# EAGLE design dataBoard (EAGLE 9.4.2)
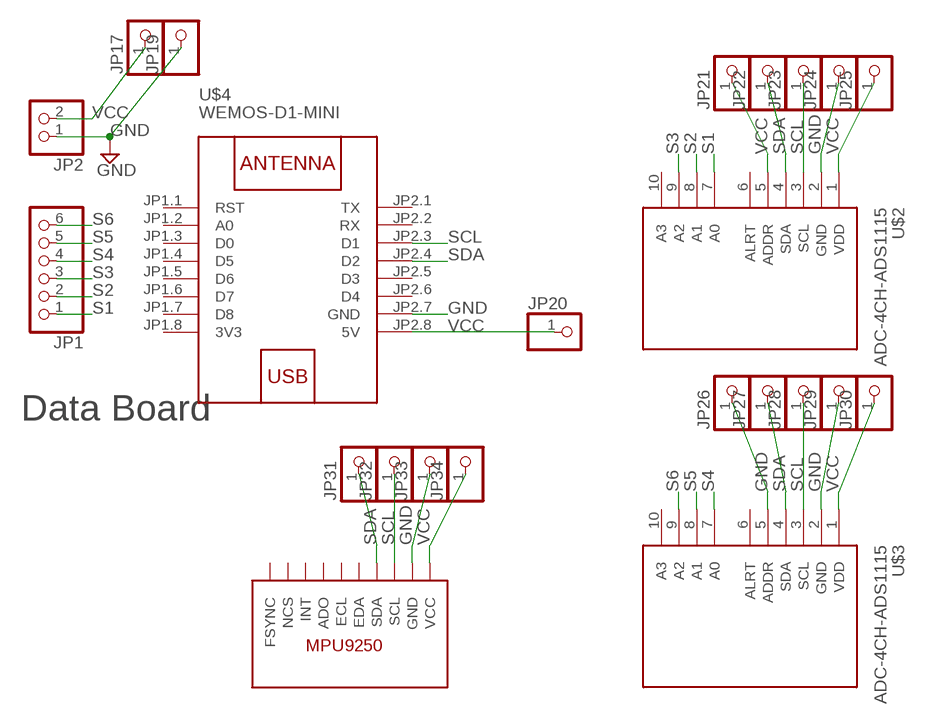
[diagram p0: schematic, sheet 1]

## Parts
JP1  PINHD-1X6  [1X06]
JP2  PINHD-1X2  [1X02]
JP17  PINHD-1X1  [1X01]
JP19  PINHD-1X1  [1X01]
JP20  PINHD-1X1  [1X01]
JP21  PINHD-1X1  [1X01]
JP22  PINHD-1X1  [1X01]
JP23  PINHD-1X1  [1X01]
JP24  PINHD-1X1  [1X01]
JP25  PINHD-1X1  [1X01]
JP26  PINHD-1X1  [1X01]
JP27  PINHD-1X1  [1X01]
JP28  PINHD-1X1  [1X01]
JP29  PINHD-1X1  [1X01]
JP30  PINHD-1X1  [1X01]
JP31  PINHD-1X1  [1X01]
JP32  PINHD-1X1  [1X01]
JP33  PINHD-1X1  [1X01]
JP34  PINHD-1X1  [1X01]
MPU1  MPU9250  [MPU9250]
U$2  ADC-4CH-ADS1115  [ADC-4CH-ADS1115]
U$3  ADC-4CH-ADS1115  [ADC-4CH-ADS1115]
U$4  WEMOS-D1-MINI  [WEMOS-D1-MINI]

## Nets
GND: JP2.1 JP19.1 JP24.1 JP26.1 JP29.1 JP33.1 MPU1.GND U$2.2(GND) U$3.2(GND) U$3.5(ADDR) U$4.JP2.7(GND)
S1: JP1.1 U$2.7(A0)
S2: JP1.2 U$2.8(A1)
S3: JP1.3 U$2.9(A2)
S4: JP1.4 U$3.7(A0)
S5: JP1.5 U$3.8(A1)
S6: JP1.6 U$3.9(A2)
SCL: JP23.1 JP28.1 JP32.1 MPU1.SCL U$2.3(SCL) U$3.3(SCL) U$4.JP2.3(D1)
SDA: JP22.1 JP27.1 JP31.1 MPU1.SDA U$2.4(SDA) U$3.4(SDA) U$4.JP2.4(D2)
VCC: JP2.2 JP17.1 JP20.1 JP21.1 JP25.1 JP30.1 JP34.1 MPU1.VCC U$2.1(VDD) U$2.5(ADDR) U$3.1(VDD) U$4.JP2.8(5V)
Unconnected: MPU1.ADO MPU1.ECL MPU1.EDA MPU1.FSYNC MPU1.INT MPU1.NCS U$2.6(ALRT) U$2.10(A3) U$3.6(ALRT) U$3.10(A3) U$4.JP1.1(RST) U$4.JP1.2(A0) U$4.JP1.3(D0) U$4.JP1.4(D5) U$4.JP1.5(D6) U$4.JP1.6(D7) U$4.JP1.7(D8) U$4.JP2.1(TX) U$4.JP2.2(RX) U$4.JP2.5(D3) U$4.JP2.6(D4)

## Notes on the sheet
- Data Board

## Power pins joined to a net without a drawn wire
3V3: U$4.JP1.8(3V3)

## Library data of the parts
JP1 = pinhead2:PINHD-1X6: PIN HEADER
JP2 = pinhead3:PINHD-1X2: PIN HEADER
JP17 JP19-JP34 = pinhead1:PINHD-1X1: PIN HEADER
MPU1 = shoe:MPU9250
U$2 U$3 = diy-modules_me:ADC-4CH-ADS1115: 4 Channel 16-Bit Analog-to-Digital Converter based on ADS1115 chip Arduino ADS1115 Getting Started Tutorial is available here: http://henrysbench.capnfatz.com/henrys-bench/arduino-voltage-measurements/arduino-ads1115-module-getting-started-tutorial/ ADS1115 datasheet is available here: http://www.ti.com/lit/ds/symlink/ads1115.pdf Click here to find device on ebay.com <http://www.ebay.com/sch/ads1115+module>
U$4 = diy-modules_me3:WEMOS-D1-MINI: WEMOS D1 mini: Mini Wi-Fi Board based on ESP-8266 device More details can be found here: https://www.wemos.cc/product/d1-mini.html Click here to find device on ebay.com <http://www.ebay.com/sch/wemos+d1+mini+nodemcu>

## Board
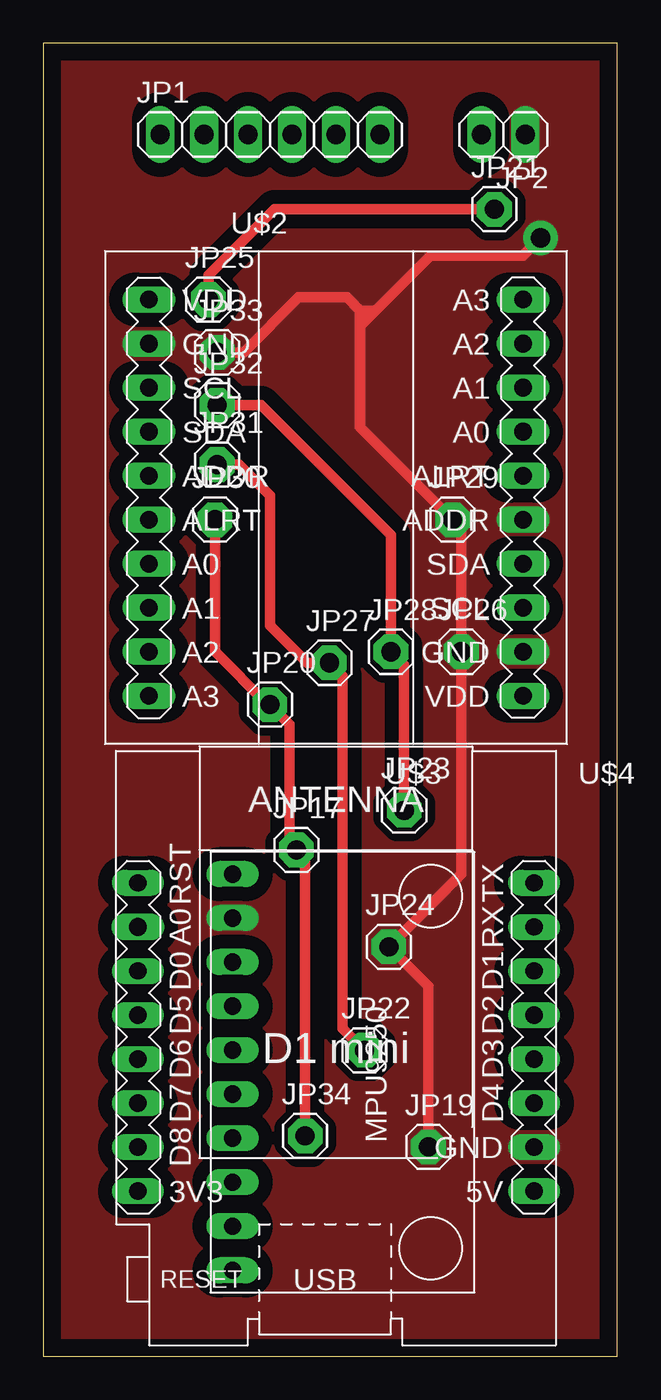
[diagram p1: board, top side]
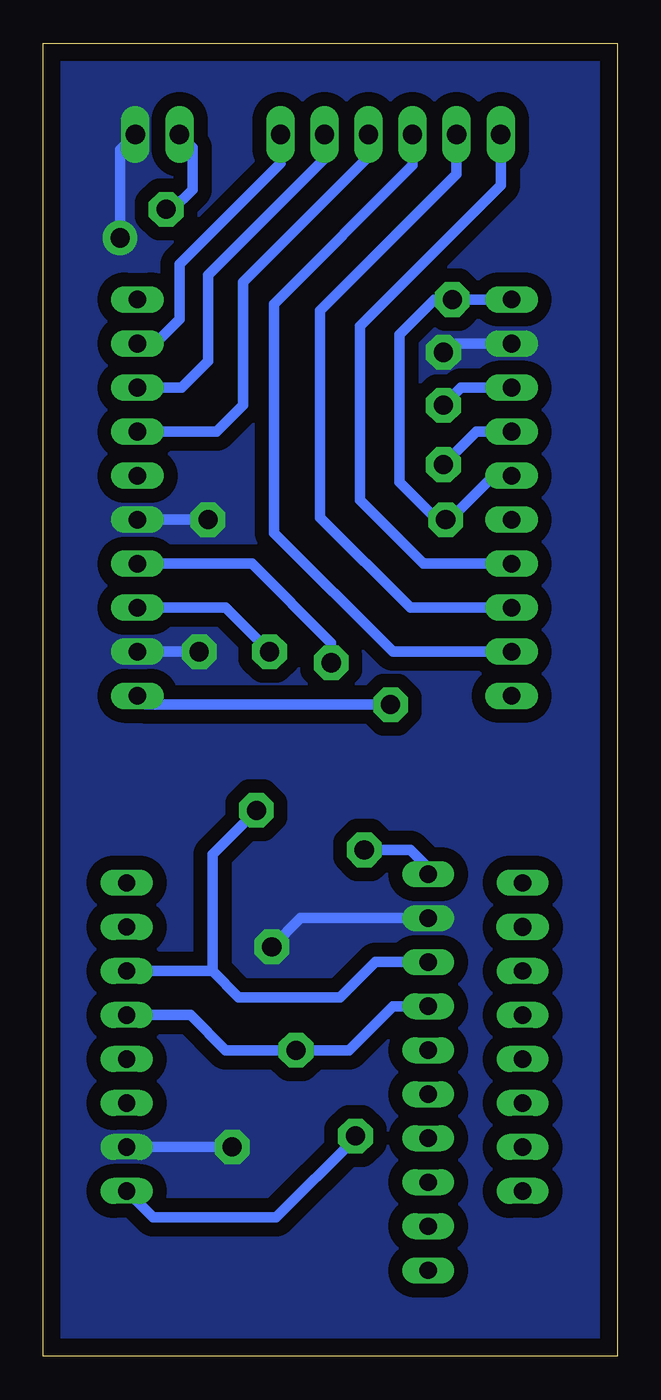
[diagram p2: board, bottom side, seen from below]

Size 33.13 x 75.74 mm. Coordinates in mm from the lower left corner, seen from the top.
Outline: 0,0 33.13,0 33.13,75.74 0,75.74 0,0
Copper layers (1*16): Top 0.035mm / dielectric 1.5mm / Bottom 0.035mm
Design rules "default": minimum track width 6mil, minimum drill 0.35mm, track to track 6mil, track to pad 6mil, pad to pad 6mil, via to via 6mil, smd to smd 6mil, copper to edge 40mil, drill to drill 6mil, minimum pad ring 10mil, minimum via ring 8mil, stop-mask expansion 4mil, vias tented up to drill 0mil, thermal gap 10mil

### Footprints (pad centres in the part's own frame; a part is rotated, then mirrored left to right if it is on the bottom)
1X06 = drill 1.1 long: 1 -6.35,0; 2 -3.81,0; 3 -1.27,0; 4 1.27,0; 5 3.81,0; 6 6.35,0
1X02 = drill 1.1 long: 1 -1.27,0; 2 1.27,0
1X01 = drill 1.1 pad 2 octagon: 1 0,0
MPU9250 = drill 1 long: ADO 3.81,-5.08; ECL 1.27,-5.08; EDA -1.27,-5.08; FSYNC 11.43,-5.08; GND -8.89,-5.08; INT 6.35,-5.08; NCS 8.89,-5.08; SCL -6.35,-5.08; SDA -3.81,-5.08; VCC -11.43,-5.08
ADC-4CH-ADS1115 = drill 1.016 long: 1 -6.35,11.43; 2 -6.35,8.89; 3 -6.35,6.35; 4 -6.35,3.81; 5 -6.35,1.27; 6 -6.35,-1.27; 7 -6.35,-3.81; 8 -6.35,-6.35; 9 -6.35,-8.89; 10 -6.35,-11.43
WEMOS-D1-MINI = drill 1 long: JP1.1 -11.43,9.525; JP1.3 -11.43,4.445; JP1.4 -11.43,1.905; JP1.5 -11.43,-0.635; JP1.6 -11.43,-3.175; JP1.7 -11.43,-5.715; JP1.8 -11.43,-8.255; JP2.1 11.43,9.525; JP2.2 11.43,6.985; JP2.3 11.43,4.445; JP2.4 11.43,1.905; JP2.5 11.43,-0.635; JP2.6 11.43,-3.175; JP2.7 11.43,-5.715; JP2.8 11.43,-8.255 | drill 1.016 long: JP1.2 -11.43,6.985

### Placement (x,y rotation side)
JP1  13.08,70.48 0 top
JP2  26.54,70.48 180 top
JP17  14.6,29.21 0 top
JP19  22.22,12.06 0 top
JP20  13.08,37.59 0 top
JP21  26.04,66.17 0 top
JP22  18.54,17.65 0 top
JP23  20.83,31.5 0 top
JP24  19.94,23.62 0 top
JP25  9.53,60.96 0 top
JP26  24.13,40.64 0 top
JP27  16.51,40.01 0 top
JP28  20.07,40.64 0 top
JP29  23.62,48.26 0 top
JP30  9.91,48.26 0 top
JP31  10.03,51.44 0 top
JP32  10.03,54.86 0 top
JP33  10.03,57.91 0 top
JP34  15.11,12.7 0 top
MPU1  16,16.38 270 top
U$2  12.45,49.53 0 top
U$3  21.34,49.53 180 top
U$4  16.89,17.78 0 top

### Tracks (layer width: path | path; a pad name or v marks a point on that pad's centre or on a via)
GND  (via drill 1.1 pad 2)
  Top 0.61: 18.29,59.44 18.29,53.59 JP29.1 24.13,47.75 JP26.1 24.13,27.81 JP24.1 22.22,21.34 JP19.1 | 18.29,59.44 18.29,60.33 | 18.29,60.33 17.53,61.09 14.73,61.09 11.56,57.91 JP33.1 | 18.29,60.33 19.18,60.33 | 19.18,60.33 18.29,59.44 | 19.18,60.33 22.35,63.5 27.69,63.5 v28.7,64.52
  Bottom 0.61: U$2.2 9.53,58.42 JP33.1 | MPU1.GND 18.29,25.27 JP24.1 | U$4.JP2.7 JP19.1 | U$3.5 JP29.1 | U$3.2 JP26.1 | JP2.1 28.7,69.6 v28.7,64.52
  pour Top (isolate 0.8, no thermals): 0,75.69 33.15,75.69 33.15,0 0,0
  pour Bottom (isolate 0.8, no thermals): 0,75.69 33.15,75.69 33.15,0 0,0
S1
  Bottom 0.61: U$2.7 11.18,45.72 14.86,49.4 14.86,59.44 6.73,67.56 JP1.1
S2
  Bottom 0.61: U$2.8 11.94,43.18 17.14,48.39 17.14,60.33 9.27,68.2 JP1.2
S3
  Bottom 0.61: U$2.9 12.95,40.64 19.81,47.5 19.81,60.71 11.81,68.71 JP1.3
S4
  Bottom 0.61: U$3.7 23.11,53.34 21.59,54.86 21.59,61.98 14.35,69.22 JP1.4
S5
  Bottom 0.61: U$3.8 25.15,55.88 23.62,57.4 23.62,62.36 16.89,69.09 JP1.5
S6
  Bottom 0.61: U$3.9 26.67,58.42 25.27,59.82 25.27,62.99 19.43,68.83 JP1.6
SCL
  Top 0.61: JP32.1 12.57,54.86 20.07,47.37 JP28.1 20.83,39.88 JP23.1
  Bottom 0.61: U$3.3 22.61,43.18 JP28.1 | 23.37,22.23 23.37,28.96 JP23.1 | U$2.3 9.02,55.88 JP32.1 | MPU1.SCL 13.97,22.73 16,20.7 21.84,20.7 23.37,22.23 | 23.37,22.23 U$4.JP2.3
SDA
  Top 0.61: JP31.1 11.3,51.44 13.08,49.66 13.08,42.16 15.24,40.01 JP27.1 17.27,39.24 17.27,18.92 JP22.1
  Bottom 0.61: U$3.4 21.08,45.72 16.51,41.15 JP27.1 | U$2.4 8.13,53.34 JP31.1 | MPU1.SDA 12.95,20.19 15.49,17.65 JP22.1 22.61,17.65 24.64,19.68 U$4.JP2.4
VCC
  Top 0.61: JP25.1 9.53,62.36 13.33,66.17 JP21.1 | JP34.1 15.11,28.7 JP17.1 14.22,29.59 14.22,36.45 JP20.1 12.95,37.59 9.91,40.64 JP30.1
  Bottom 0.61: U$4.JP2.8 26.8,8 19.68,8 15.11,12.57 JP34.1 | MPU1.VCC 10.92,28.19 11.94,29.21 JP17.1 | U$2.1 JP25.1 10.54,60.96 12.57,58.93 12.57,50.42 10.41,48.26 JP30.1 9.65,48.26 7.11,50.8 U$2.5 | JP20.1 27.18,37.59 U$3.1 | JP21.1 25.65,66.17 24.51,67.31 24.51,69.72 JP2.2

### Text on the board
bValues: Data Board